# EAGLE design preamp (EAGLE 6.2)
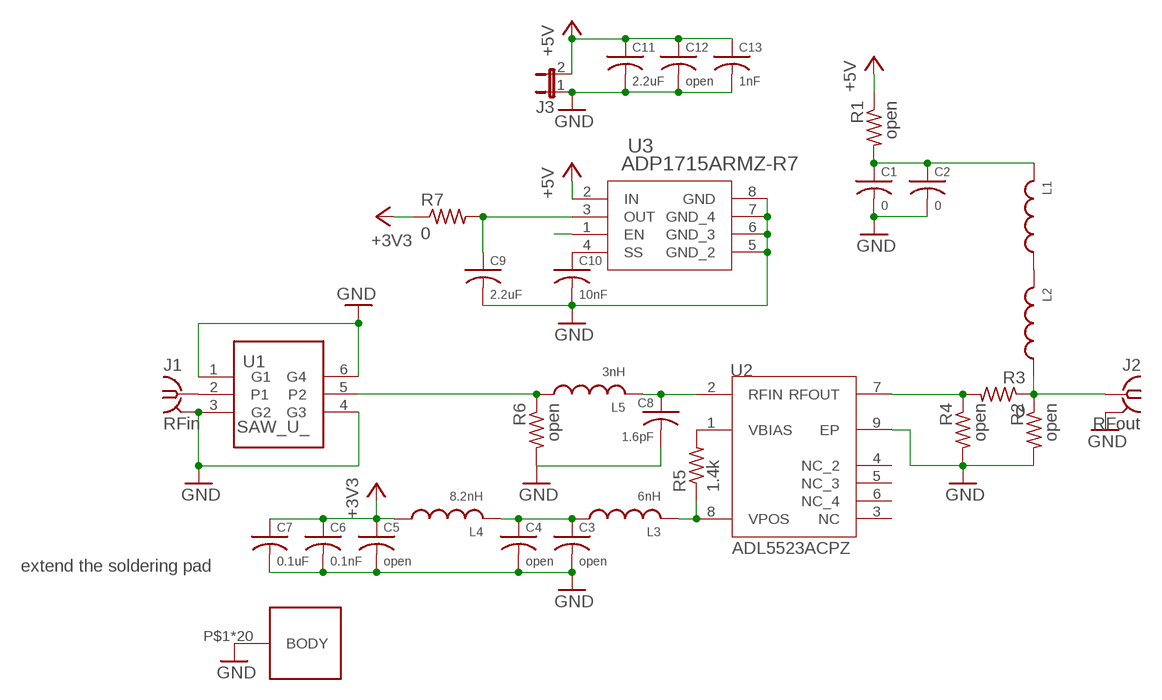
[diagram p0: schematic, sheet 1]

## Parts
C1  0  C-USC0603  [C0603]
C2  0  C-USC0603  [C0603]
C3  open  C-USC0603  [C0603]
C4  open  C-USC0603  [C0603]
C5  open  C-USC0603  [C0603]
C6  0.1nF  C-USC0603  [C0603]
C7  0.1uF  C-USC0603  [C0603]
C8  1.6pF  C-USC0603  [C0603]
C9  2.2uF  C-USC0603  [C0603]
C10  10nF  C-USC0603  [C0603]
C11  2.2uF  C-USC0603  [C0603]
C12  open  C-USC0603  [C0603]
C13  1nF  C-USC0603  [C0603]
J1  RFin  SMA-142-0711-821/826  [J502-ND-142-0711-821/826]
J2  RFout  SMA-142-0711-821/826  [J502-ND-142-0711-821/826]
J3  JP1E  [JP1]
L1  L-USL0603  [L0603]
L2  L-USL0603  [L0603]
L3  6nH  L-USL0603  [L0603]
L4  8.2nH  L-USL0603  [L0603]
L5  3nH  L-USL0603  [L0603]
R1  open  R-US_R0603  [R0603]
R2  open  R-US_R0603  [R0603]
R3  0  R-US_R0603  [R0603]
R4  open  R-US_R0603  [R0603]
R5  1.4k  R-US_R0603  [R0603]
R6  open  R-US_R0603  [R0603]
R7  0  R-US_R0603  [R0603]
U1  SAW_U_  [SAW_U]
U2  ADL5523ACPZ  [CP8-2_DZ]
U3  ADP1715ARMZ-R7  [RM_8]
U10  BMI-S-X03  [BMI-S-X03]

## Nets
+3V3: C5.1 C6.1 C7.1 L4.1 R7.1
+5V: C11.1 C12.1 C13.1 J3.2 R1.1 U3.1(EN) U3.2(IN)
ADP1715_3: C9.1 R7.2 U3.3(OUT)
GND: C1.2 C2.2 C3.2 C4.2 C5.2 C6.2 C7.2 C8.2 C9.2 C10.2 C11.2 C12.2 C13.2 J1.G@1(GND) J2.G@1(GND) J3.1 R2.2 R4.2 R6.2 U1.1(G1) U1.3(G2) U1.4(G3) U1.6(G4) U2.9(EP) U3.5(GND_2) U3.6(GND_3) U3.7(GND_4) U3.8(GND) U10.P$1(BODY) U10.P$2(BODY) U10.P$3(BODY) U10.P$4(BODY) U10.P$5(BODY) U10.P$6(BODY) U10.P$7(BODY) U10.P$8(BODY) U10.P$10(BODY) U10.P$11(BODY) U10.P$12(BODY) U10.P$13(BODY) U10.P$14(BODY) U10.P$15(BODY) U10.P$16(BODY) U10.P$17(BODY) U10.P$18(BODY) U10.P$19(BODY) U10.P$20(BODY) U10.P$21(BODY)
N$1: L1.1 L2.2
N$3: R5.2 U2.1(VBIAS)
N$4: C1.1 C2.1 L1.2 R1.2
N$7: J1.1 U1.2(P1)
N$12: C3.1 C4.1 L3.1 L4.2
N$29: C8.1 L5.2 U2.2(RFIN)
N$30: L5.1 R6.1 U1.5(P2)
N$32: L3.2 R5.1 U2.8(VPOS)
N$43: C10.1 U3.4(SS)
N$45: R3.2 R4.1 U2.7(RFOUT)
N$49: J2.1 L2.1 R2.1 R3.1
Unconnected: U2.3(NC) U2.4(NC_2) U2.5(NC_3) U2.6(NC_4)

## Notes on the sheet
- extend the soldering pad

## Power pins joined to a net without a drawn wire
GND: J1.G@2(GND) J1.G@3(GND) J1.G@4(GND) J2.G@2(GND) J2.G@3(GND) J2.G@4(GND)

## Library data of the parts
C1-C13 = rcl-dz1:C-US: CAPACITOR, American symbol
J1 J2 = con-coax_dz:SMA-: SMA 50 Ohm End Launch Jack Receptacle - Round Contact Johnson Components Source: www.johnsoncomponents.com .. J502-ND.pdf; MF: JOHNSON COMPONENTS; MPN: 142-0711-821; OC_FARNELL: 1019328; OC_NEWARK: 16F3627
J3 = jumper:JP1E: JUMPER
L1-L5 = rcl-dz1:L-US: INDUCTOR, American symbol
R1-R7 = rcl-dz1:R-US_: RESISTOR, American symbol
U1 = saw_dz:SAW_U
U2 = dzhang:ADL5523ACPZ
U3 = analog-devices_dz:ADP1715ARMZ-R7
U10 = dzhang:BMI-S-X03

## Board
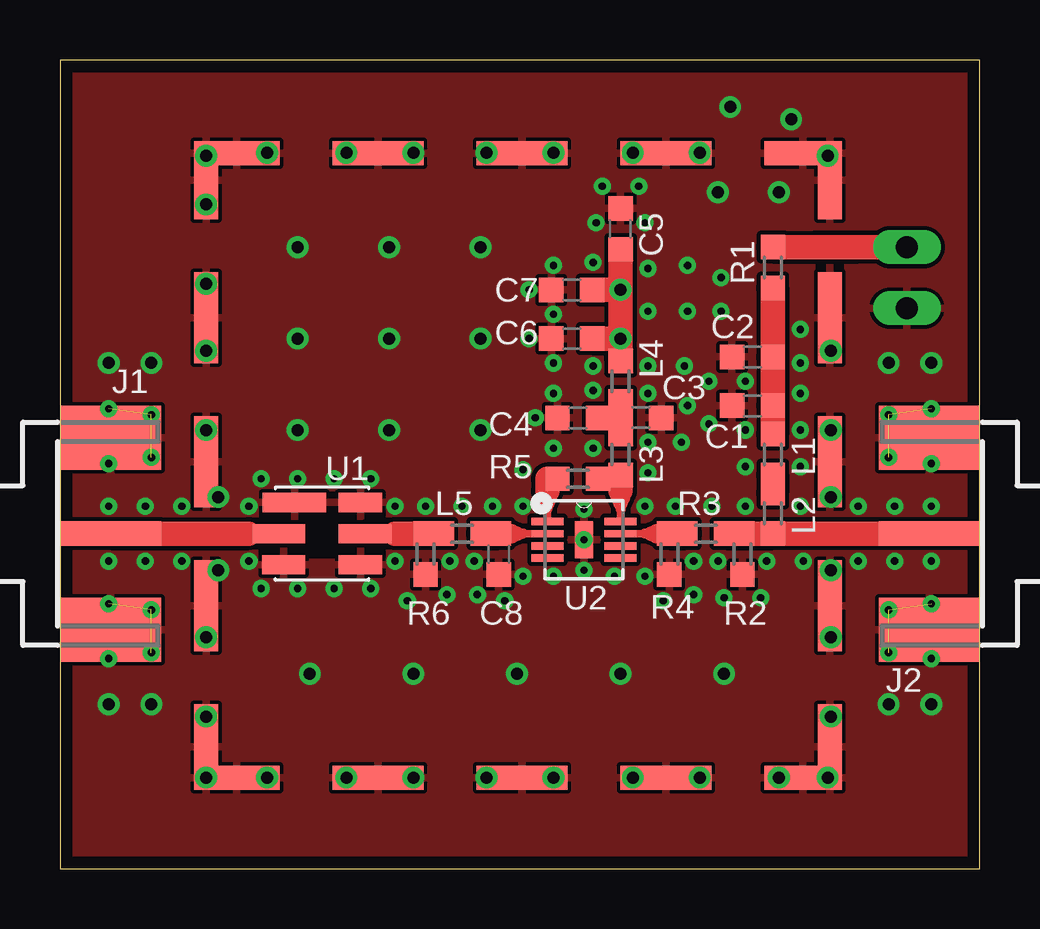
[diagram p1: board, top side]
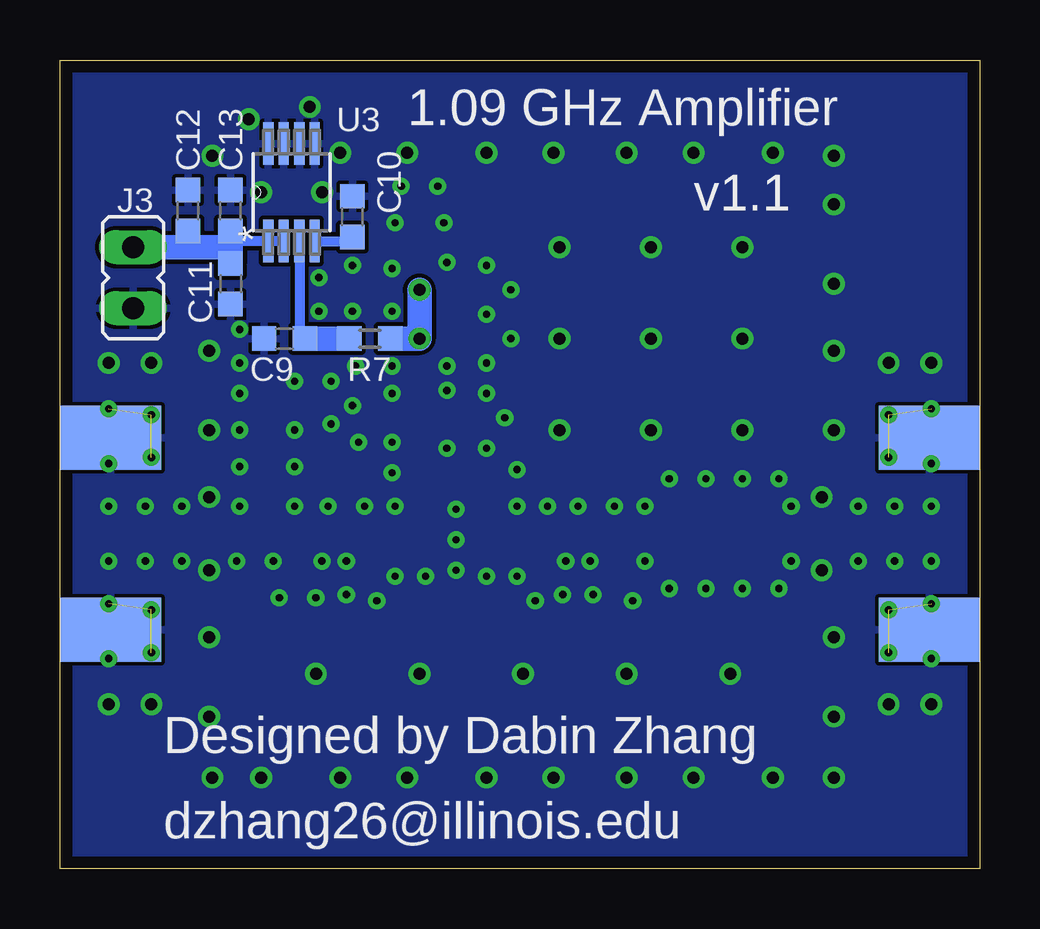
[diagram p2: board, bottom side, seen from below]

Size 38.35 x 33.71 mm. Coordinates in mm from the lower left corner, seen from the top.
Outline: 0,0 38.33,0 38.33,33.71 0,33.71 0,0
Copper layers (1*16): Top 0.035mm / dielectric 1.5mm / Bottom 0.035mm
Design rules: minimum track width 10mil, minimum drill 24mil, track to track 7mil, track to pad 7mil, pad to pad 7mil, via to via 7mil, smd to smd 7mil, copper to edge 20mil, drill to drill 10mil, minimum pad ring 10mil, minimum via ring 8mil, stop-mask expansion 4mil, vias tented up to drill 0mil, thermal gap 6mil
tRestrict: area 9.9,13 to 11.9,14.5

### Footprints (pad centres in the part's own frame; a part is rotated, then mirrored left to right if it is on the bottom)
C0603 = smd 1.016 x 1.016: 1 -0.85,0; 2 0.85,0
J502-ND-142-0711-821/826 = smd 4.191 x 1.016: 1 2.115,0 | smd 4.191 x 2.667: G@1 2.115,4.003; G@2 2.115,-4.003 | smd 4.191 x 2.667 bottom: G@3 2.115,4.003; G@4 2.115,-4.003
JP1 = drill 0.914 long: 1 0,-1.27; 2 0,1.27
L0603 = smd 1.016 x 1.016: 1 -0.85,0; 2 0.85,0
R0603 = smd 1.016 x 1.016: 1 -0.85,0; 2 0.85,0
SAW_U = smd 2.65 x 0.8: 1 1.15,-1.3 | smd 2.2 x 0.8: 2 1.8,0; 5 -1.8,0 | smd 1.8 x 0.8: 3 1.6,1.3; 4 -1.6,1.3; 6 -1.6,-1.3
CP8-2_DZ = smd 1.321 x 0.305: 1 -1.524,0.762; 2 -1.524,0.254; 3 -1.524,-0.254; 4 -1.524,-0.762; 5 1.524,-0.762; 6 1.524,-0.254; 7 1.524,0.254; 8 1.524,0.762 | smd 0.762 x 1.524: 9 0,0
RM_8 = smd 1.778 x 0.432: 1 -2.032,0.965; 2 -2.032,0.33; 3 -2.032,-0.33; 4 -2.032,-0.965; 5 2.032,-0.965; 6 2.032,-0.33; 7 2.032,0.33; 8 2.032,0.965
BMI-S-X03 = smd 3.8 x 1: P$1 7.67,0.5; P$3 7.67,26.51; P$4 13.67,0.5; P$5 19.67,0.5; P$19 13.67,26.51; P$20 19.67,26.51 | smd 3.57 x 1: P$2 1.785,0.5; P$10 1.785,26.51 | smd 3.24 x 1: P$6 25.39,0.5; P$21 25.39,26.51 | smd 1 x 3.57: P$7 26.51,1.785; P$14 0.5,1.785 | smd 1 x 3.8: P$8 26.51,7.67; P$11 26.51,13.67; P$12 26.51,19.67; P$15 0.5,7.67; P$16 0.5,13.67; P$17 0.5,19.67 | smd 1 x 3.24: P$13 26.51,25.39; P$18 0.5,25.39

### Placement (x,y rotation side)
C1  28.87,19.3 180 top
C2  28.87,21.34 180 top
C3  24.22,18.8 0 top
C4  21.59,18.8 180 top
C5  23.37,26.67 90 top
C6  21.34,22.1 180 top
C7  21.34,24.13 180 top
C8  18.29,13.12 270 top
C9  28.99,22.1 180 bottom
C10  26.16,27.18 90 bottom
C11  31.24,24.38 270 bottom
C12  33.02,27.43 90 bottom
C13  31.24,27.43 90 bottom
J1  0,13.97 0 top
J2  38.35,13.97 180 top
J3  35.31,24.64 0 bottom
L1  29.72,17.27 90 top
L2  29.72,14.82 90 top
L3  23.37,17.27 270 top
L4  23.37,20.32 270 top
L5  16.76,13.97 0 top
R1  29.72,25.06 270 top
R2  28.45,13.12 270 top
R3  26.92,13.97 180 top
R4  25.4,13.12 270 top
R5  21.59,16.26 180 top
R6  15.24,13.12 270 top
R7  25.44,22.1 180 bottom
U1  10.92,13.97 180 top
U2  21.84,13.72 0 top
U3  28.7,28.19 90 bottom
U10  5.59,3.3 0 top

### Tracks (layer width: path | path; a pad name or v marks a point on that pad's centre or on a via)
+3V3  (via drill 0.5)
  Top 1.016: C5.1 v23.37,24.13 | v23.37,24.13 v23.37,22.1 | C6.1 v23.37,22.1 | C7.1 v23.37,24.13 | L4.1 v23.37,22.1
  Bottom 1.016: R7.1 v23.37,22.1 v23.37,24.13
+5V
  Top 1.016: J3.2 33.27,25.91 | 33.27,25.91 31.5,25.91 | R1.1 33.27,25.91
  Bottom 0.406: U3.2 U3.1 30.99,26.16 31.24,25.91
  Bottom 1.016: J3.2 33.02,25.91 | 33.02,25.91 31.5,25.91 31.24,26.16 C13.1 31.24,25.91 C11.1 | C12.1 33.02,25.91
ADP1715_3
  Bottom 0.406: U3.3 28.37,22.33 C9.1
  Bottom 1.016: R7.2 C9.1
GND  (via drill 0.3, 0.5)  (8 unrouted)
  other vias: 21.84,13.72 21.84,12.45 21.84,14.99 23.11,12.19 20.57,12.19 24.38,12.19 19.3,12.19 19.3,15.11 24.38,15.11 25.65,15.11 28.57,15.11 18.03,15.11 27.18,15.11 16.76,15.11 15.24,15.11 13.97,15.11 17.4,11.43 16.26,12.83 17.27,12.83 16.13,11.43 18.54,11.18 14.48,11.18 13.97,12.83 12.95,11.68 11.43,11.68 9.91,11.68 8.38,11.68 12.95,16.26 11.43,16.26 9.91,16.26 8.38,16.26 7.87,12.83 7.87,15.11 26.42,12.83 27.43,12.83 25.15,11.18 26.42,11.43 27.69,11.3 29.21,11.3 29.46,12.83 30.99,12.83 30.86,15.11 24.51,17.78 24.51,16.51 25.91,17.78 26.16,19.3 24.51,19.81 24.51,20.95 19.3,16.64 20.57,17.53 22.23,17.53 19.81,18.8 20.57,19.81 22.23,19.94 20.57,21.08 22.23,20.95 19.56,22.1 19.56,24.13 20.57,23.11 20.57,25.15 22.23,25.27 22.35,26.92 22.61,28.45 24.13,28.45 24.38,26.92 24.51,25.02 24.51,23.24 30.86,16.76 30.86,18.29 30.86,19.81 30.86,21.08 30.86,22.48 28.57,16.76 28.57,18.29 27.05,18.54 27.05,20.32 28.57,20.32 26.04,20.95 27.56,23.24 26.16,23.24 27.56,24.64 5.08,15.11 3.56,15.11 2.03,15.11 2.03,12.83 3.56,12.83 5.08,12.83 33.27,15.11 33.27,12.83 34.8,12.83 36.32,12.83 34.8,15.11 36.32,15.11 6.1,3.81 8.64,3.81 11.94,3.81 14.73,3.81 17.78,3.81 20.57,3.81 23.88,3.81 26.67,3.81 29.97,3.81 32,3.81 6.1,6.35 6.1,9.65 6.6,12.45 6.1,29.72 6.1,27.69 6.1,24.38 6.1,21.59 6.1,18.29 6.6,15.49 8.64,29.84 11.94,29.84 14.73,29.84 17.78,29.84 20.57,29.84 23.88,29.84 26.67,29.84 32,29.72 32.13,6.35 32.13,9.65 32.13,12.45 32.13,15.49 32.13,18.29 32.13,21.59 10.41,8.13 14.73,8.13 19.05,8.13 23.37,8.13 27.69,8.13 9.91,25.91 13.72,25.91 17.53,25.91 9.91,22.1 9.91,18.29 13.72,18.29 17.53,18.29 17.53,22.1 13.72,22.1 3.81,17.14 3.81,18.92 2.03,16.89 2.03,19.18 3.81,10.79 3.81,9.02 2.03,8.76 2.03,11.05 34.54,17.14 34.54,18.92 36.32,16.89 36.32,19.18 34.54,10.79 34.54,9.02 36.32,8.76 36.32,11.05 2.03,6.86 3.81,6.86 2.03,21.08 3.81,21.08 36.32,6.86 34.54,6.86 36.32,21.08 34.54,21.08 30.48,31.24 27.94,31.75 29.97,28.19 27.43,28.19 26.16,25.15
  pour Bottom: 0,33.78 38.35,33.78 38.35,0 0,0
  pour Top: 0,33.78 38.35,33.78 38.35,0 0,0
N$1
  Top 1.016: L1.1 L2.2
N$3
  Top 0.305: U2.1 20.32,14.99
  Top 0.406: 20.32,15.24 20.32,14.99
  Top 0.61: 20.32,15.49 20.32,15.24
  Top 0.813: 20.32,15.75 20.32,15.49
  Top 1.016: R5.2 20.32,16.26 20.32,15.75
N$4
  Top 1.016: R1.2 C2.1 C1.1 L1.2
N$7
  Top 0.813: U1.2 7.87,13.97
  Top 1.016: J1.1 7.87,13.97
N$12
  Top 1.016: C4.1 C3.1 | L4.2 C3.1 | L3.1 C3.1
N$29
  Top 0.305: 19.3,13.97 U2.2
  Top 0.406: 19.05,13.97 19.3,13.97
  Top 0.61: 18.8,13.97 19.05,13.97
  Top 0.813: C8.1 18.8,13.97
  Top 1.016: L5.2 C8.1
N$30
  Top 0.813: U1.5 13.97,13.97
  Top 1.016: 13.97,13.97 R6.1 L5.1
N$32
  Top 0.305: 23.34,16.23 L3.2 23.37,16.26 R5.1 | 23.37,14.99 U2.8
  Top 0.406: 23.37,15.24 23.37,14.99
  Top 0.61: 23.37,15.49 23.37,15.24
  Top 0.813: 23.37,15.75 23.37,15.49
  Top 1.016: 23.34,16.23 23.37,16.23 23.37,15.75
N$43
  Bottom 0.406: U3.4 26.38,26.16 C10.1
N$45
  Top 0.305: R4.1 | U2.7 24.38,13.97
  Top 0.406: 24.64,13.97 24.38,13.97
  Top 0.61: 24.89,13.97 24.64,13.97
  Top 0.813: R4.1 24.89,13.97
  Top 1.016: R4.1 R3.2
N$49
  Top 1.016: R3.1 R2.1 L2.1 J2.1

### Text on the board
bPlace: 1.09 GHz Amplifier | v1.1 | Designed by Dabin Zhang | dzhang26@illinois.edu